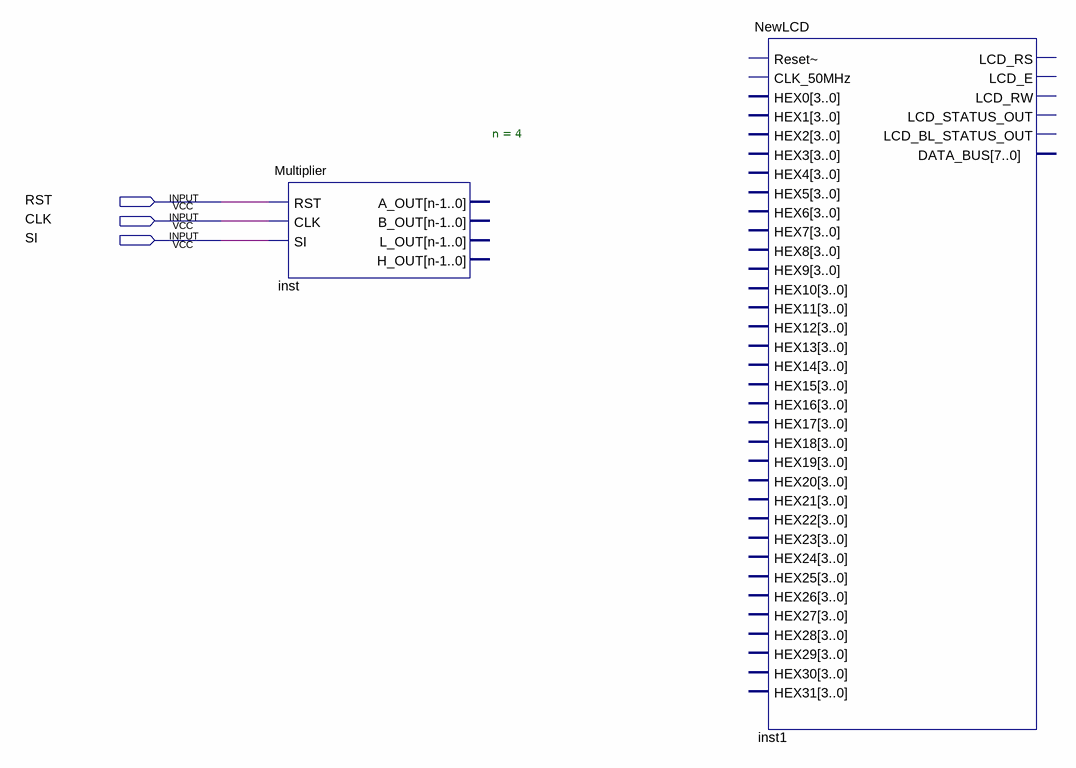
[diagram p0: schematic sheet]
// Quartus schematic Multiplier_LCD.bdf as structural Verilog: 2 symbols, 3 pins
module Multiplier_LCD (
  input  RST,
  input  CLK,
  input  SI
);

  Multiplier #(.n(4)) inst (.RST(RST), .CLK(CLK), .SI(SI));  // open: A_OUT, B_OUT, L_OUT, H_OUT
  NewLCD inst1 ();  // open: Reset~, CLK_50MHz, HEX0, HEX1, HEX2, HEX3, HEX4, HEX5, HEX6, HEX7, HEX8, HEX9, HEX10, HEX11, HEX12, HEX13, HEX14, HEX15, HEX16, HEX17, HEX18, HEX19, HEX20, HEX21, HEX22, HEX23, HEX24, HEX25, HEX26, HEX27, HEX28, HEX29, HEX30, HEX31, LCD_RS, LCD_E, LCD_RW, LCD_STATUS_OUT, LCD_BL_STATUS_OUT, DATA_BUS
endmodule
